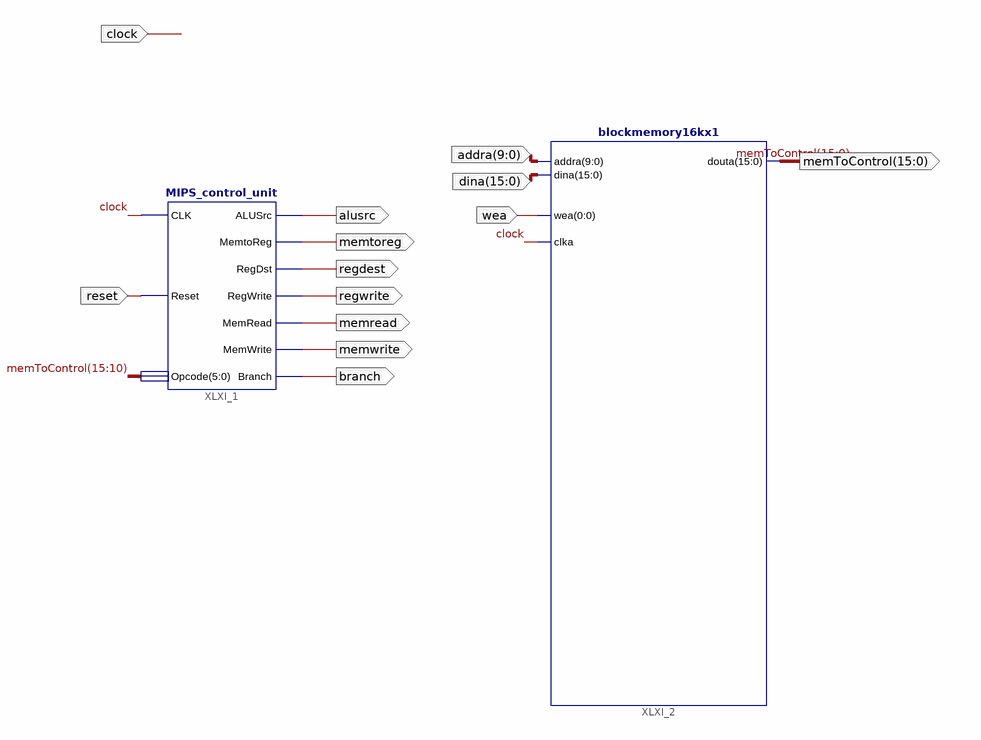
[diagram p0: schematic sheet 1]
// Xilinx ISE schematic whatever.sch (spartan3e) as structural Verilog: 2 symbols, 13 ports
module whatever (
  input  [9:0] addra,
  input  [15:0] dina,
  input  wea,
  input  clock,
  input  reset,
  output [15:0] memToControl,
  output alusrc,
  output memtoreg,
  output regdest,
  output regwrite,
  output memread,
  output memwrite,
  output branch
);

  blockmemory16kx1 XLXI_2 (.addra(addra), .dina(dina), .wea(wea), .clka(clock), .douta(memToControl));
  MIPS_control_unit XLXI_1 (
    .CLK(clock), .Reset(reset), .Opcode(memToControl[15:10]), .ALUSrc(alusrc), .MemtoReg(memtoreg),
    .RegDst(regdest), .RegWrite(regwrite), .MemRead(memread), .MemWrite(memwrite), .Branch(branch));
endmodule
